# EAGLE design V-00797-00 (EAGLE 7.2.0)

## Sheet 1 of 2
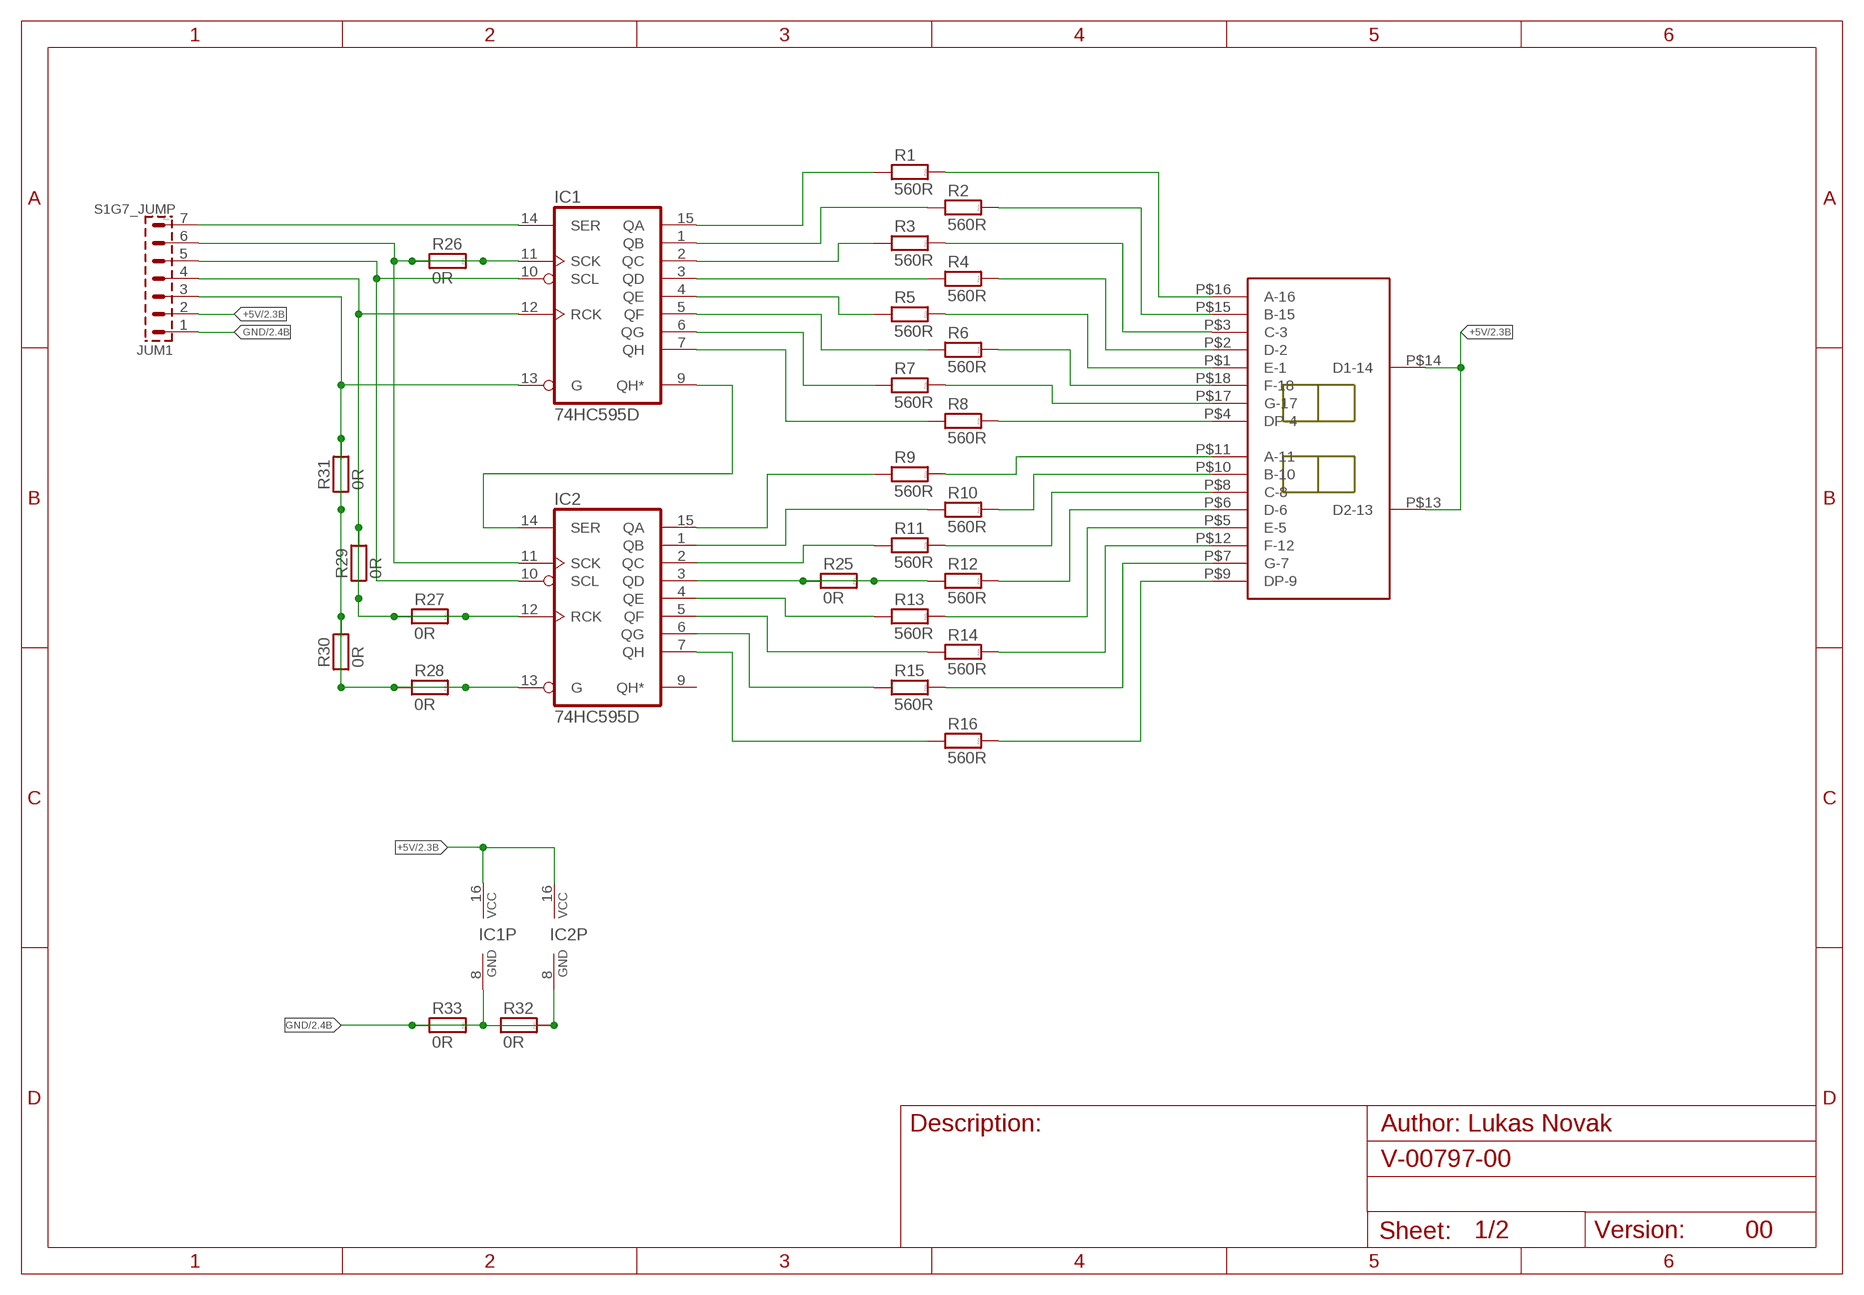
[diagram p0: schematic, sheet 1]

### Parts
IC1  74HC595D  [SO16]
IC2  74HC595D  [SO16]
JUM1  S1G7_JUMP  [S1G7_JUM]
R1  560R  R_1206  [1206]
R2  560R  R_1206  [1206]
R3  560R  R_1206  [1206]
R4  560R  R_1206  [1206]
R5  560R  R_1206  [1206]
R6  560R  R_1206  [1206]
R7  560R  R_1206  [1206]
R8  560R  R_1206  [1206]
R9  560R  R_1206  [1206]
R10  560R  R_1206  [1206]
R11  560R  R_1206  [1206]
R12  560R  R_1206  [1206]
R13  560R  R_1206  [1206]
R14  560R  R_1206  [1206]
R15  560R  R_1206  [1206]
R16  560R  R_1206  [1206]
R25  0R  R_1206  [1206]
R26  0R  R_1206  [1206]
R27  0R  R_1206  [1206]
R28  0R  R_1206  [1206]
R29  0R  R_1206  [1206]
R30  0R  R_1206  [1206]
R31  0R  R_1206  [1206]
R32  0R  R_1206  [1206]
R33  0R  R_1206  [1206]
U$1  BD-A544RD  [BD-A544RD]

### Nets
+5V: IC1.16(VCC) IC2.16(VCC) JUM1.2 U$1.P$13(D2-13) U$1.P$14(D1-14) ; also sheet 2
GND: IC1.8(GND) IC2.8(GND) JUM1.1 R32.1 R32.2 R33.1 R33.2 ; also sheet 2
N$1: R1.2 U$1.P$16(A-16)
N$2: R2.2 U$1.P$15(B-15)
N$3: R3.2 U$1.P$3(C-3)
N$4: R4.2 U$1.P$2(D-2)
N$5: R5.2 U$1.P$1(E-1)
N$6: R6.2 U$1.P$18(F-18)
N$7: R7.2 U$1.P$17(G-17)
N$8: R8.2 U$1.P$4(DP-4)
N$9: IC1.9(QH*) IC2.14(SER)
N$10: IC1.15(QA) R1.1
N$11: IC1.1(QB) R2.1
N$12: IC1.2(QC) R3.1
N$13: IC1.3(QD) R4.1
N$14: IC1.4(QE) R5.1
N$15: IC1.5(QF) R6.1
N$16: IC1.6(QG) R7.1
N$17: IC1.7(QH) R8.1
N$18: IC2.1(QB) R10.1
N$19: IC2.2(QC) R11.1
N$20: IC2.3(QD) R12.1 R25.1 R25.2
N$21: IC2.15(QA) R9.1
N$22: IC2.7(QH) R16.1
N$23: IC2.6(QG) R15.1
N$24: IC2.5(QF) R14.1
N$25: IC2.4(QE) R13.1
N$26: R9.2 U$1.P$11(A-11)
N$27: R10.2 U$1.P$10(B-10)
N$28: R11.2 U$1.P$8(C-8)
N$29: R12.2 U$1.P$6(D-6)
N$30: R13.2 U$1.P$5(E-5)
N$31: R14.2 U$1.P$12(F-12)
N$32: R15.2 U$1.P$7(G-7)
N$33: R16.2 U$1.P$9(DP-9)
N$34: IC1.14(SER) JUM1.7
N$35: IC1.11(SCK) IC2.11(SCK) JUM1.6 R26.1 R26.2
N$36: IC1.10(SCL) IC2.10(SCL) JUM1.5
N$37: IC1.12(RCK) IC2.12(RCK) JUM1.4 R27.1 R27.2 R29.1 R29.2
N$38: IC1.13(G) IC2.13(G) JUM1.3 R28.1 R28.2 R30.1 R30.2 R31.1 R31.2
Unconnected: IC2.9(QH*)

### Notes on the sheet
- 00

## Sheet 2 of 2
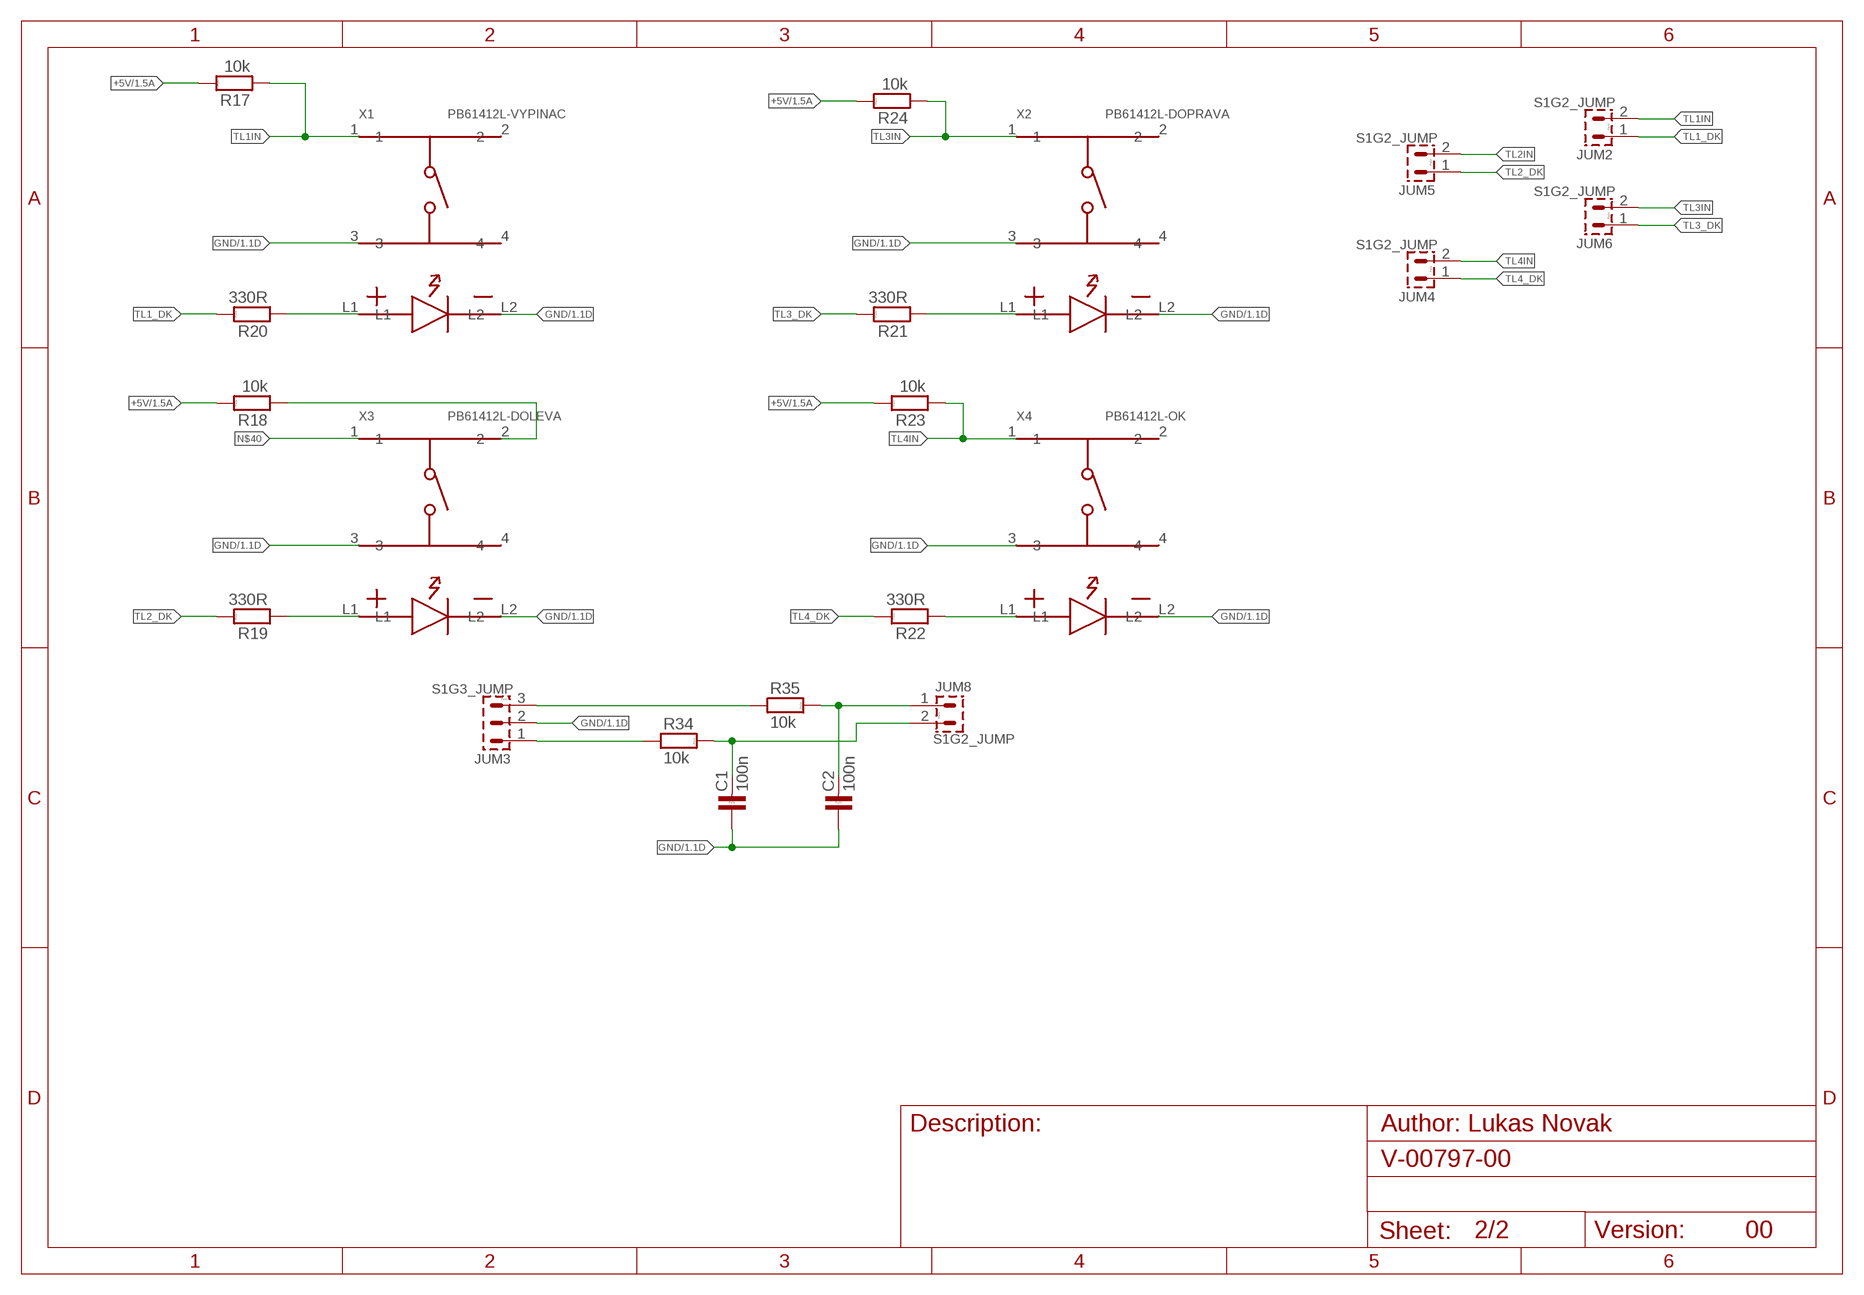
[diagram p1: schematic, sheet 2]

### Parts
C1  100n  C-KER_1206  [1206]
C2  100n  C-KER_1206  [1206]
JUM2  S1G2_JUMP  [S1G2_JUM]
JUM3  S1G3_JUMP  [S1G3_JUM]
JUM4  S1G2_JUMP  [S1G2_JUM]
JUM5  S1G2_JUMP  [S1G2_JUM]
JUM6  S1G2_JUMP  [S1G2_JUM]
JUM8  S1G2_JUMP  [S1G2_JUM]
R17  10k  R_1206  [1206]
R18  10k  R_1206  [1206]
R19  330R  R_1206  [1206]
R20  330R  R_1206  [1206]
R21  330R  R_1206  [1206]
R22  330R  R_1206  [1206]
R23  10k  R_1206  [1206]
R24  10k  R_1206  [1206]
R34  10k  R_1206  [1206]
R35  10k  R_1206  [1206]
X1  PB61412L-VYPINAC  PB61412L-NEUTRAL  [PB1412L-101]
X2  PB61412L-DOPRAVA  PB61412L-NEUTRAL  [PB1412L-101]
X3  PB61412L-DOLEVA  PB61412L-NEUTRAL  [PB1412L-101]
X4  PB61412L-OK  PB61412L-NEUTRAL  [PB1412L-101]

### Nets
+5V: R17.2 R18.2 R23.2 R24.2 ; also sheet 1
ENCODER_A: JUM3.3 R35.1
ENCODER_B: JUM3.1 R34.1
GND: C1.1 C2.1 JUM3.2 X1.3 X1.L2 X2.3 X2.L2 X3.3 X3.L2 X4.3 X4.L2 ; also sheet 1
INT1: C2.2 JUM8.1 R35.2
N$40: X3.1
N$41: R20.1 X1.L1
N$47: R21.1 X2.L1
N$49: R19.1 X3.L1
N$51: R22.1 X4.L1
OCB1: C1.2 JUM8.2 R34.2
TL1_DK: JUM2.1 R20.2
TL1IN: JUM2.2 R17.1 X1.1
TL2_DK: JUM5.1 R19.2
TL2IN: JUM5.2 R18.1 X3.2
TL3_DK: JUM6.1 R21.2
TL3IN: JUM6.2 R24.1 X2.1
TL4_DK: JUM4.1 R22.2
TL4IN: JUM4.2 R23.1 X4.1
Unconnected: X1.2 X1.4 X2.2 X2.4 X3.4 X4.2 X4.4

### Notes on the sheet
- 00

## Library data of the parts
C1 C2 = #PaJa_31:C-KER: Kondenzator - keramicky
IC1 IC2 = 74xx-eu:74*595: 8-bit SHIFT REGISTER, output latch
JUM1 = #PaJa_konektory:S1G7_JUMP: Radove konektory - koliky - 7x
JUM2 JUM4-JUM6 JUM8 = #PaJa_konektory:S1G2_JUMP: Radove konektory - koliky - 2x
JUM3 = #PaJa_konektory:S1G3_JUMP: Radove konektory - koliky - 3x
R1-R35 = #PaJa_31:R: Rezistor
U$1 = LED_Knihovna:BD-A544RD
X1-X4 = LIC_ALL-00:PB61412L

## Board
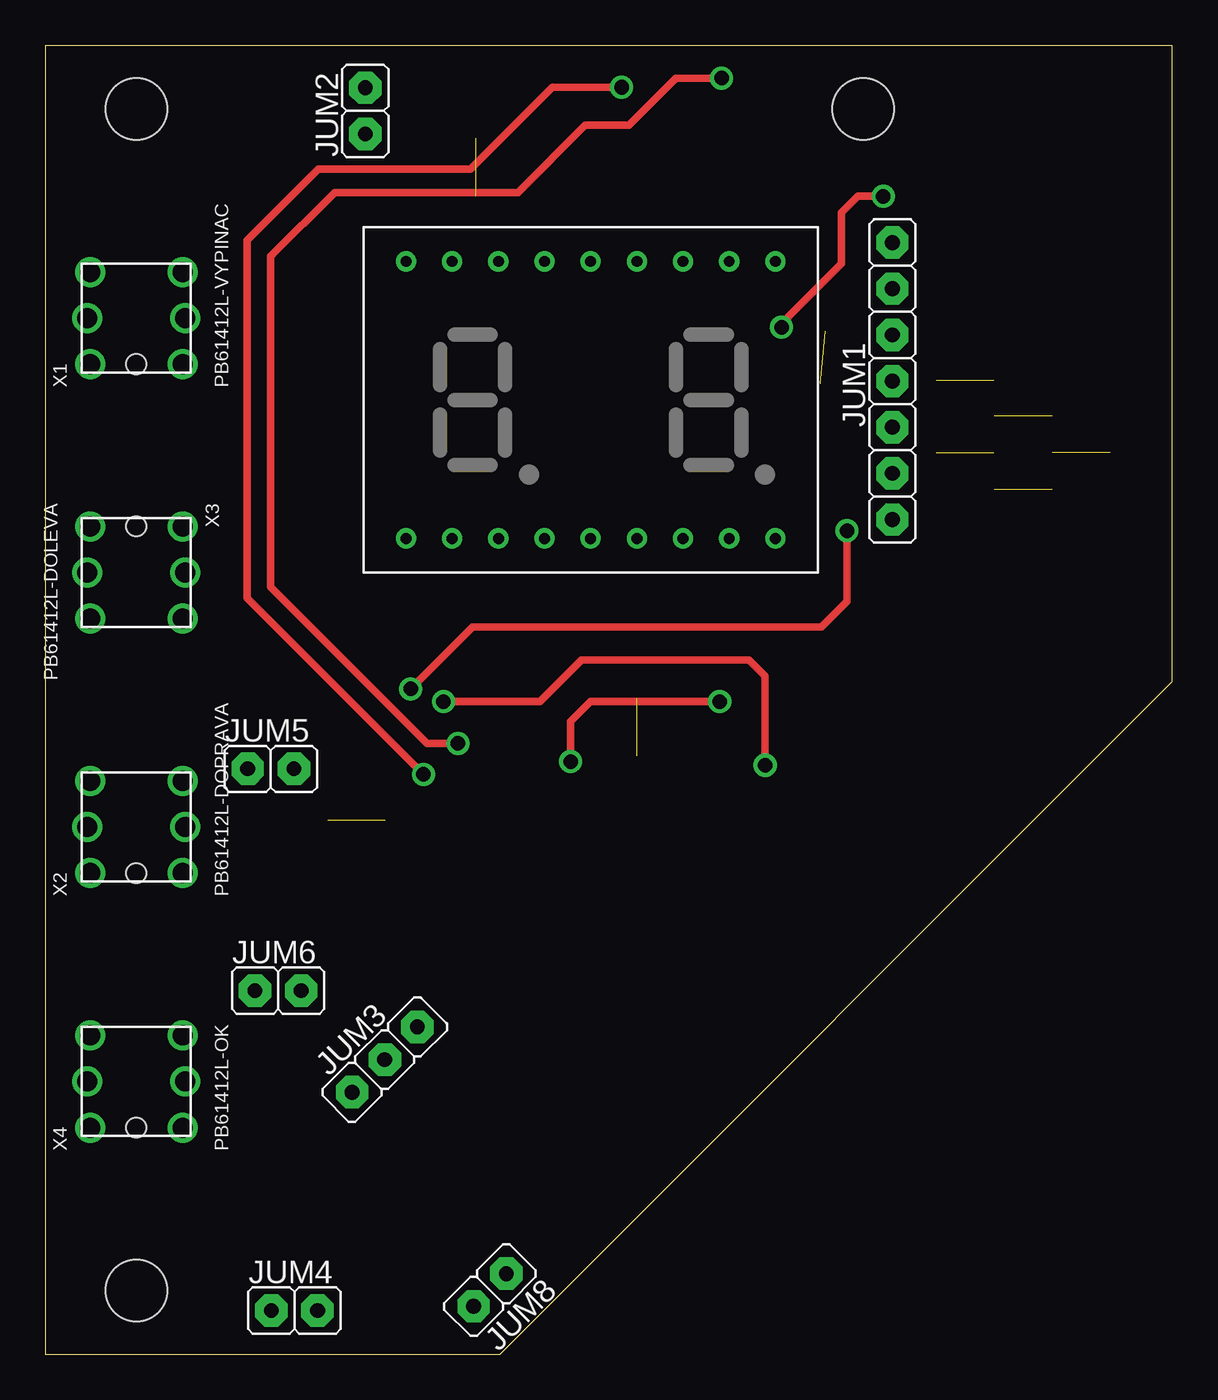
[diagram p2: board, top side]
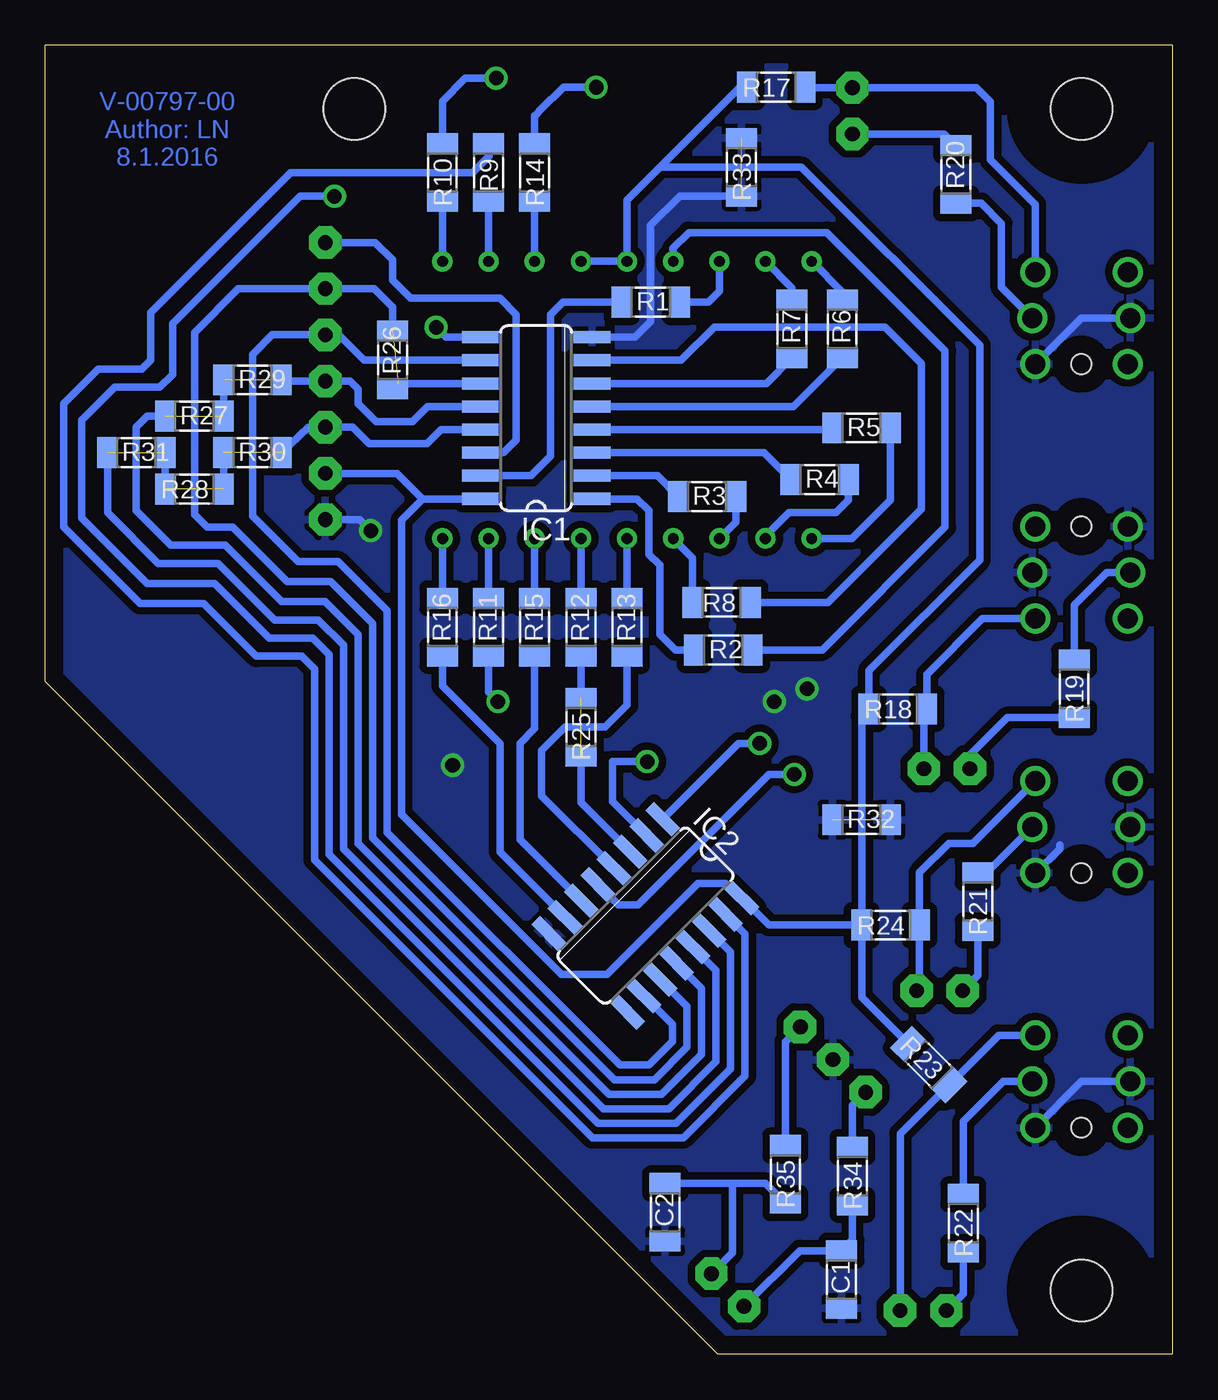
[diagram p3: board, bottom side, seen from below]

Size 62 x 72 mm. Coordinates in mm from the lower left corner, seen from the top.
Outline: 0,0 25,0 62,37 62,72 0,72 0,0
Copper layers (1*16): Top 0.035mm / dielectric 1.5mm / Bottom 0.035mm
Design rules "default": minimum track width 10mil, minimum drill 24mil, track to track 8mil, track to pad 8mil, pad to pad 8mil, via to via 8mil, smd to smd 8mil, copper to edge 40mil, drill to drill 8mil, minimum pad ring 10mil, minimum via ring 8mil, stop-mask expansion 4mil, vias tented up to drill 0mil, thermal gap 10mil
Holes 3.4 mm at 5,3.5 5,68.5 45,68.5
tRestrict: area 1.5,65 to 8.5,72; area 41.5,65 to 48.5,72; area 1.5,0 to 8.5,7
bRestrict: area 1.5,65 to 8.5,72; area 41.5,65 to 48.5,72; area 1.5,0 to 8.5,7
vRestrict: area 1.5,65 to 8.5,72; area 41.5,65 to 48.5,72; area 1.5,0 to 8.5,7

### Footprints (pad centres in the part's own frame; a part is rotated, then mirrored left to right if it is on the bottom)
1206 = smd 1.143 x 1.702: 1 -1.587,0; 2 1.587,0
SO16 = smd 0.66 x 2.032: 1 -4.445,-3.073; 2 -3.175,-3.073; 3 -1.905,-3.073; 4 -0.635,-3.073; 5 0.635,-3.073; 6 1.905,-3.073; 7 3.175,-3.073; 8 4.445,-3.073; 9 4.445,3.073; 10 3.175,3.073; 11 1.905,3.073; 12 0.635,3.073; 13 -0.635,3.073; 14 -1.905,3.073; 15 -3.175,3.073; 16 -4.445,3.073
S1G7_JUM = drill 0.813 pad 1.778 octagon: 1 -7.62,0; 2 -5.08,0; 3 -2.54,0; 4 0,0; 5 2.54,0; 6 5.08,0; 7 7.62,0
S1G2_JUM = drill 0.813 pad 1.778 octagon: 1 -1.27,0; 2 1.27,0
S1G3_JUM = drill 0.813 pad 1.778 octagon: 1 -2.54,0; 2 0,0; 3 2.54,0
BD-A544RD = drill 0.6: P$1 -10.16,-7.62; P$2 -7.62,-7.62; P$3 -5.08,-7.62; P$4 -2.54,-7.62; P$5 0,-7.62; P$6 2.54,-7.62; P$7 5.08,-7.62; P$8 7.62,-7.62; P$9 10.16,-7.62; P$10 10.16,7.62; P$11 7.62,7.62; P$12 5.08,7.62; P$13 2.54,7.62; P$14 0,7.62; P$15 -2.54,7.62; P$16 -5.08,7.62; P$17 -7.62,7.62; P$18 -10.16,7.62
PB1412L-101 = drill 1.1: 1 2.54,-2.54; 2 2.54,2.54; 3 -2.54,-2.54; 4 -2.54,2.54; L1 0,-2.7; L2 0,2.7 | hole 1.1: -2.54,0

### Placement (x,y rotation side)
C1  18.2,4.1 90 bottom
C2  27.9,7.8 90 bottom
IC1  35,51.5 90 bottom
IC2  28.99,24.12 225 bottom
JUM1  46.6,53.54 90 top
JUM2  17.6,68.4 90 top
JUM3  18.67,16.2 45 top
JUM4  13.7,2.4 0 top
JUM5  12.4,32.2 0 top
JUM6  12.8,20 0 top
JUM8  24.46,3.52 225 top
R1  28.7,57.88 0 bottom
R2  24.7,38.74 0 bottom
R3  25.6,47.18 0 bottom
R4  19.4,48.12 0 bottom
R5  17.1,50.96 0 bottom
R6  18.16,56.4 90 bottom
R7  20.92,56.4 90 bottom
R8  24.8,41.36 180 bottom
R9  37.62,65 270 bottom
R10  40.16,65 270 bottom
R11  37.62,40 90 bottom
R12  32.54,40 90 bottom
R13  30,40 90 bottom
R14  35.08,65 270 bottom
R15  35.08,40 90 bottom
R16  40.16,40 90 bottom
R17  21.8,69.7 180 bottom
R18  15.1,35.5 180 bottom
R19  5.4,36.6 270 bottom
R20  11.9,64.9 90 bottom
R21  10.7,24.9 270 bottom
R22  11.5,7.2 270 bottom
R23  13.4,15.93 135 bottom
R24  15.5,23.6 180 bottom
R25  32.54,34.5 270 bottom
R26  42.9,54.7 90 bottom
R27  53.8,51.6 0 bottom
R28  53.8,47.6 180 bottom
R29  50.6,53.6 0 bottom
R30  50.6,49.6 0 bottom
R31  57,49.6 0 bottom
R32  17.1,29.4 0 bottom
R33  23.7,65.3 270 bottom
R34  17.6,9.8 270 bottom
R35  21.29,9.89 270 bottom
U$1  30,52.5 0 top
X1  5,57 90 top
X2  5,29 90 top
X3  5,43 270 top
X4  5,15 90 top

### Tracks (layer width: path | path; a pad name or v marks a point on that pad's centre or on a via)
+5V
  Bottom 0.406: U$1.P$13 U$1.P$14 30,63.5 28.2,65.3 | IC1.16 41.24,47.05 | JUM1.2 42.65,48.46 41.24,47.05 | 41.24,47.05 42.4,45.9 42.4,29.7 33.6,20.9 31.1,20.9 26.1,25.9 24.59,25.9 IC2.16 22.19,23.6 R24.2 | R17.2 23.8,69.7 28.2,65.3 | R24.2 17.09,35.1 R18.2 16.69,37.61 10.6,43.7 10.6,55.5 20.4,65.3 28.2,65.3 | R23.2 17.09,19.62 R24.2
ENCODER_A
  Bottom 0.406: JUM3.3 21.29,17.17 R35.1
ENCODER_B
  Bottom 0.406: JUM3.1 17.6,13.68 R34.1
GND  (via drill 0.8 pad 1.27)  (2 unrouted)
  Top 0.406: v20.1,36.6 23.5,40 42.7,40 44.1,41.4 v44.1,45.3 | v21.9,35.9 27.2,35.9 29.5,38.2 38.7,38.2 39.6,37.3 v39.6,32.4
  Bottom 0.406: v20.1,36.6 20.1,36.5 | JUM1.1 44.72,45.92 v44.1,45.3 | X1.L2 5,57 X1.3 | X4.3 5,15 X4.L2 | IC1.8 29.55,55.95 28.7,56.8 28.7,62.11 27.1,63.71 R33.2 | X2.3 6.2,27.8 6.2,28
  pour Bottom (isolate 0.406): 0,0 25,0 62,37 62,72 0,72
INT1
  Bottom 0.406: R35.2 22.38,9.39 24.2,9.39 | 24.2,9.39 C2.2 | JUM8.1 24.2,5.58 24.2,9.39
N$1
  Bottom 0.406: U$1.P$16 24.92,58.47 25.51,57.88 R1.2
N$2
  Bottom 0.406: U$1.P$15 27.46,60.84 26.6,61.7 19,61.7 12.5,55.2 12.5,45.5 19.26,38.74 R2.2
N$3
  Bottom 0.406: R3.2 24.01,45.79 U$1.P$3
N$4
  Bottom 0.406: U$1.P$2 22.38,45.02 21.1,46.3 18.5,46.3 17.81,46.99 R4.2
N$5
  Bottom 0.406: U$1.P$1 17.62,44.88 15.51,46.99 R5.2
N$6
  Bottom 0.406: R6.2 18.16,58.44 U$1.P$18
N$7
  Bottom 0.406: R7.2 20.92,58.66 U$1.P$17
N$8
  Bottom 0.406: R8.2 26.39,43.81 U$1.P$4
N$9  (via drill 0.8 pad 1.27)
  Top 0.406: v40.5,56.5 40.5,56.7 43.8,60 43.8,62.8 44.7,63.7 v46.1,63.7
  Bottom 0.406: IC2.14 24.3,22.11 24.3,15.7 27.3,12.7 31.6,12.7 46.4,27.5 46.4,38.5 47.3,39.4 49.7,39.4 52.7,42.4 56.4,42.4 60,46 60,51.4 58.2,53.2 55.7,53.2 55,53.9 55,56.7 48,63.7 v46.1,63.7 | IC1.9 39.95,55.95 v40.5,56.5
N$10
  Bottom 0.406: R1.1 33.52,57.88 34.2,57.2 34.2,49.4 35.27,48.33 IC1.15
N$11
  Bottom 0.406: R2.1 27.34,38.74 28.2,39.6 28.2,43.4 28.8,44 28.8,46.4 29.45,47.05 IC1.1
N$12
  Bottom 0.406: IC1.2 28.33,48.33 R3.1
N$13
  Bottom 0.406: IC1.3 22.46,49.59 R4.1
N$14
  Bottom 0.406: IC1.4 18.78,50.87 R5.1
N$15
  Bottom 0.406: IC1.5 20.84,52.13 R6.1
N$16
  Bottom 0.406: IC1.6 22.33,53.41 R7.1
N$17
  Bottom 0.406: R8.1 18.94,41.36 13.8,46.5 13.8,54.5 15.8,56.5 25.2,56.5 27.02,54.67 IC1.7
N$18  (via drill 0.8 pad 1.27)
  Top 0.406: v22.7,33.6 21,33.6 12.4,42.2 12.4,60.4 15.9,63.9 26,63.9 29.7,67.6 32.1,67.6 34.7,70.2 v37.2,70.2
  Bottom 0.406: IC2.1 23.86,33.6 v22.7,33.6 | v37.2,70.2 38.9,70.2 40.16,68.94 R10.1
N$19  (via drill 0.8 pad 1.27)
  Top 0.406: v28.9,32.6 28.9,34.8 30,35.9 v37.1,35.9
  Bottom 0.406: R11.1 37.62,36.42 v37.1,35.9 | IC2.2 30.8,30.41 30.8,32.6 v28.9,32.6
N$20  (1 unrouted)
  Bottom 0.406: R12.1 R25.1 | IC2.3 32.54,30.35 R25.2
N$21
  Bottom 0.406: IC2.15 23.5,23.11 23.5,15.3 26.9,11.9 31.9,11.9 47.2,27.2 47.2,37.7 47.9,38.4 50.4,38.4 53.3,41.3 56.8,41.3 61,45.5 61,52.3 59.1,54.2 56.7,54.2 56.2,54.7 56.2,57.3 48.5,65 38.5,65 37.6,65.9 37.6,66.57 R9.1
N$22
  Bottom 0.406: IC2.7 37,27.63 37,33.6 40.16,36.76 R16.1
N$23
  Bottom 0.406: R15.1 35.08,34.42 35.9,33.6 35.9,28.33 IC2.6
N$24  (via drill 0.8 pad 1.27)
  Top 0.406: v20.8,31.9 11.1,41.6 11.1,61.3 15,65.2 23.4,65.2 27.9,69.7 v31.7,69.7
  Bottom 0.406: IC2.5 30.48,24.7 29.4,24.7 22.2,31.9 v20.8,31.9 | v31.7,69.7 33.5,69.7 34.75,68.45 35,68.2 35.08,68.12 R14.1
N$25
  Bottom 0.406: R13.1 30,35.7 31.2,34.5 33.4,34.5 34.7,33.2 34.7,30.72 IC2.4
N$26
  Bottom 0.406: U$1.P$11 R9.2
N$27
  Bottom 0.406: U$1.P$10 R10.2
N$28
  Bottom 0.406: U$1.P$8 R11.2
N$29
  Bottom 0.406: U$1.P$6 R12.2
N$30
  Bottom 0.406: U$1.P$5 R13.2
N$31
  Bottom 0.406: U$1.P$12 R14.2
N$32
  Bottom 0.406: U$1.P$7 R15.2
N$33
  Bottom 0.406: U$1.P$9 R16.2
N$34
  Bottom 0.406: IC1.14 36.8,49.59 36.1,50.3 36.1,57.2 37,58.1 41.9,58.1 42.9,59.1 42.9,60.2 43.86,61.16 JUM1.7
N$35  (1 unrouted)
  Bottom 0.406: IC2.11 26.7,19.13 26.7,16.9 28.5,15.1 30.7,15.1 44,28.4 44,40.2 46.3,42.5 48.7,42.5 51.7,45.5 53.1,45.5 53.8,46.2 53.8,56.2 51.38,58.62 JUM1.6 43.92,58.62 42.9,57.6 R26.2 | IC1.11 42.61,53.41 R26.1
N$36
  Bottom 0.406: IC2.10 27.5,18.13 27.5,17.2 28.8,15.9 30.4,15.9 43.2,28.7 43.2,40.9 45.9,43.6 48.1,43.6 50.6,46.1 50.6,55 49.52,56.08 JUM1.5 | JUM1.5 49.08,56.08 | IC1.10 44.48,54.67 45.88,56.08 JUM1.5
N$37  (2 unrouted)
  Bottom 0.406: IC2.12 25.9,20.12 25.9,16.5 28.1,14.3 31,14.3 44.8,28.1 44.8,39.6 46.6,41.4 49,41.4 52.1,44.5 55.1,44.5 57,46.4 57,51 56.4,51.6 R27.1 | IC1.12 40.97,52.13 41.8,51.3 43.8,51.3 44.8,52.3 44.8,53.1 45.24,53.54 JUM1.4 48.95,53.54 R29.2 | R29.1 52.19,51.62 R27.2
N$38  (3 unrouted)
  Bottom 0.406: IC2.13 25.1,21.12 25.1,16.1 27.7,13.5 31.3,13.5 45.6,27.8 45.6,39 47,40.4 49.4,40.4 52.5,43.5 55.8,43.5 58.59,46.29 R31.1 | IC1.13 40.23,50.87 41,50.1 44.2,50.1 45.1,51 JUM1.3 47.52,51 R30.2 | R30.1 52.19,47.62 R28.1 | R31.2 55.41,47.62 R28.2
N$41
  Bottom 0.406: X1.L1 9.4,58.7 9.4,62.2 10.51,63.31 R20.1
N$47
  Bottom 0.406: X2.L1 10.21,26.49 R21.1
N$49
  Bottom 0.406: X3.L1 3.6,43 5.4,41.2 R19.1
N$51
  Bottom 0.406: X4.L1 9.3,15 11.5,12.8 R22.1
OCB1
  Bottom 0.406: R34.2 17.6,6.29 C1.2 20.5,5.69 JUM8.2
TL1_DK
  Bottom 0.406: JUM2.1 12.54,67.13 R20.2
TL1IN
  Bottom 0.406: R17.1 20.18,69.67 JUM2.2 10.77,69.67 10,68.9 10,65.7 7.54,63.24 X1.1
TL2_DK
  Bottom 0.406: R19.2 9.09,35.01 11.13,32.97 JUM5.1
TL2IN
  Bottom 0.406: JUM5.2 13.67,35.34 R18.1 13.5,35.51 13.5,37.4 10.44,40.46 X3.2
TL3_DK
  Bottom 0.406: JUM6.1 10.7,20.83 R21.2
TL3IN
  Bottom 0.406: X2.1 10.98,28.1 12.3,28.1 13.91,26.49 R24.1 13.91,20.16 JUM6.2
TL4_DK
  Bottom 0.406: R22.2 11.5,3.33 JUM4.1
TL4IN
  Bottom 0.406: X4.1 9.55,17.54 R23.1 14.97,12.12 JUM4.2

### Text on the board
Bottom: V-00797-00 / Author: LN / 8.1.2016